# EAGLE schematic Thetis_RevF6_SCH (EAGLE 9.7.0)
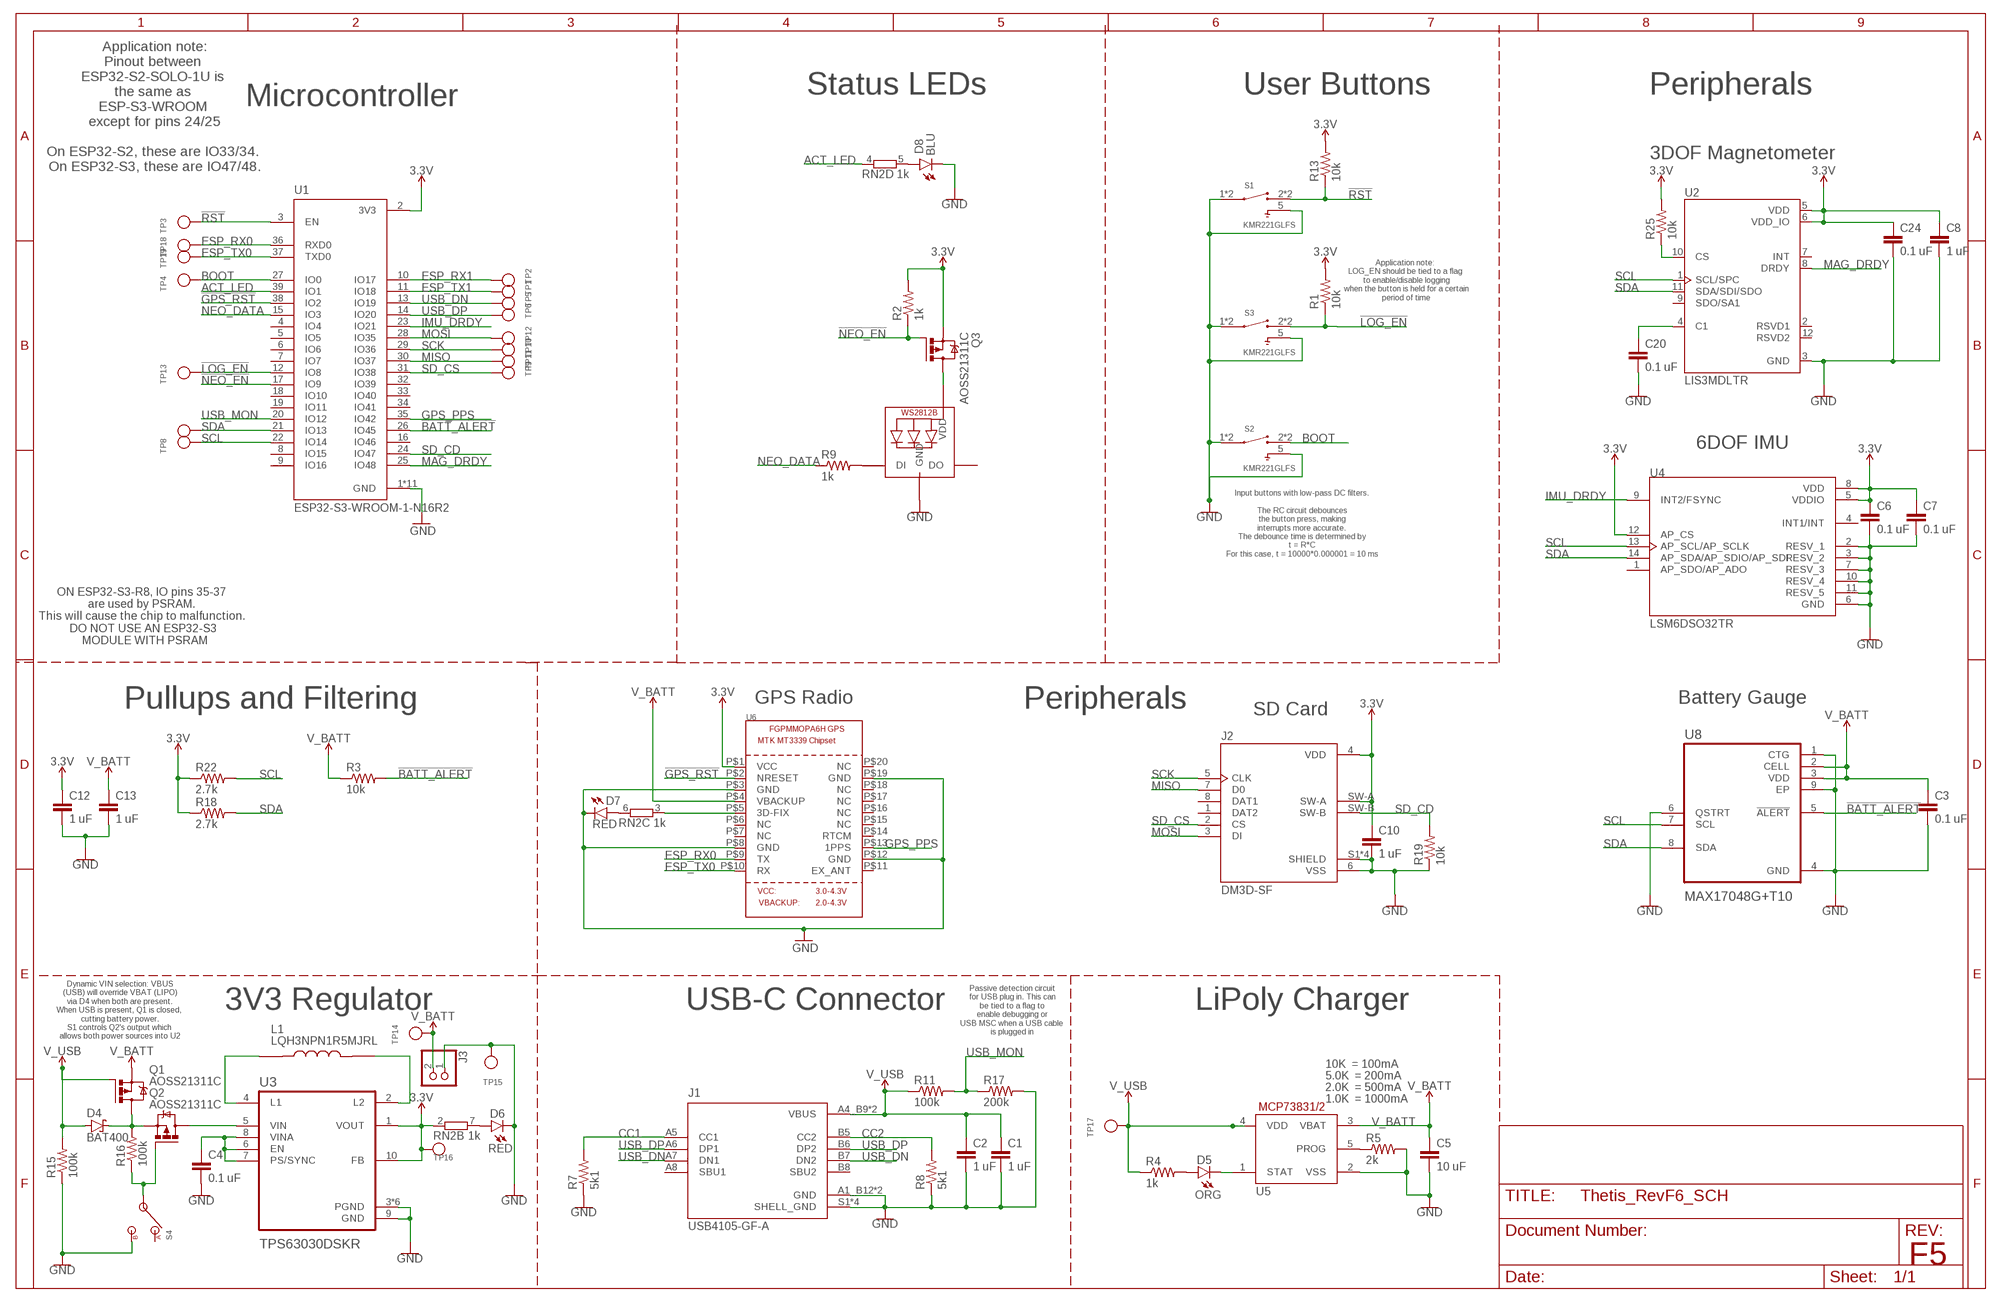
[diagram p0: schematic, sheet 1]

## Parts
C1  1 uF  C-EUC0603  [C0603]
C2  1 uF  C-EUC0603  [C0603]
C3  0.1 uF  C-EUC0603  [C0603]
C4  0.1 uF  C-EUC0603  [C0603]
C5  10 uF  C-EUC0603  [C0603]
C6  0.1 uF  C-EUC0603  [C0603]
C7  0.1 uF  C-EUC0603  [C0603]
C8  1 uF  C-EUC0603  [C0603]
C10  1 uF  C-EUC0603  [C0603]
C12  1 uF  C-EUC0603  [C0603]
C13  1 uF  C-EUC0603  [C0603]
C20  0.1 uF  C-EUC0603  [C0603]
C24  0.1 uF  C-EUC0603  [C0603]
D4  BAT400  BAS40  [SOT23]
D5  ORG  CHIP-ROUND-G_0603  [LEDC1608X65N]
D6  RED  CHIP-ROUND-G_0603  [LEDC1608X65N]
D7  RED  CHIP-FLAT-Y_0603-0.35MM  [LEDC1608X35N]
D8  BLU  CHIP-ROUND-G_0603  [LEDC1608X65N]
J1  USB4105-GF-A  [GCT_USB4105-GF-A]
J2  DM3D-SF  [HRS_DM3D-SF]
J3  JST_2PIN  [JSTPH2]
L1  LQH3NPN1R5MJRL  [IND_LQH3NPN1R5MJRL]
LED1  WS2812B3535  [LED3535]
Q1  AOSS21311C  PMOSFET_BSS84  [SOT23]
Q2  AOSS21311C  PMOSFET_BSS84  [SOT23]
Q3  AOSS21311C  PMOSFET_BSS84  [SOT23]
R1  10k  R-US_R0603  [R0603]
R2  1k  R-US_R0603  [R0603]
R3  10k  R-US_R0603  [R0603]
R4  1k  R-US_R0603  [R0603]
R5  2k  R-US_R0603  [R0603]
R7  5k1  R-US_R0603  [R0603]
R8  5k1  R-US_R0603  [R0603]
R9  1k  R-US_R0603  [R0603]
R11  100k  R-US_R0603  [R0603]
R13  10k  R-US_R0603  [R0603]
R15  100k  R-US_R0603  [R0603]
R16  100k  R-US_R0603  [R0603]
R17  200k  R-US_R0603  [R0603]
R18  2.7k  R-US_R0603  [R0603]
R19  10k  R-US_R0603  [R0603]
R22  2.7k  R-US_R0603  [R0603]
R25  10k  R-US_R0603  [R0603]
RN2  1k  4R-NEXBN8V  [EXBN8V]
S1  KMR221GLFS  [SW_KMR221GLFS]
S2  KMR221GLFS  [SW_KMR221GLFS]
S3  KMR221GLFS  [SW_KMR221GLFS]
S4  CL-SB-12X  [CL-SB-12A]
TP1  TESTPOINT1.5X2.0MM_NOCREAM  [PAD-1.5X2.0]
TP2  TESTPOINT1.5X2.0MM_NOCREAM  [PAD-1.5X2.0]
TP3  TESTPOINT1.5X2.0MM_NOCREAM  [PAD-1.5X2.0]
TP4  TESTPOINT1.5X2.0MM_NOCREAM  [PAD-1.5X2.0]
TP5  TESTPOINT1.5X2.0MM_NOCREAM  [PAD-1.5X2.0]
TP6  TESTPOINT1.5X2.0MM_NOCREAM  [PAD-1.5X2.0]
TP7  TESTPOINT1.5X2.0MM_NOCREAM  [PAD-1.5X2.0]
TP8  TESTPOINT1.5X2.0MM_NOCREAM  [PAD-1.5X2.0]
TP9  TESTPOINT1.5X2.0MM_NOCREAM  [PAD-1.5X2.0]
TP10  TESTPOINT1.5X2.0MM_NOCREAM  [PAD-1.5X2.0]
TP11  TESTPOINT1.5X2.0MM_NOCREAM  [PAD-1.5X2.0]
TP12  TESTPOINT1.5X2.0MM_NOCREAM  [PAD-1.5X2.0]
TP13  TESTPOINT1.5X2.0MM_NOCREAM  [PAD-1.5X2.0]
TP14  TESTPOINT1.5X2.0MM_NOCREAM  [PAD-1.5X2.0]
TP15  TESTPOINT1.5X2.0MM_NOCREAM  [PAD-1.5X2.0]
TP16  TESTPOINT1.5X2.0MM_NOCREAM  [PAD-1.5X2.0]
TP17  TESTPOINT1.5X2.0MM_NOCREAM  [PAD-1.5X2.0]
TP18  TESTPOINT1.5X2.0MM_NOCREAM  [PAD-1.5X2.0]
TP19  TESTPOINT1.5X2.0MM_NOCREAM  [PAD-1.5X2.0]
U1  ESP32-S3-WROOM-1-N16R2  [XCVR_ESP32-S3-WROOM-1-N16R2]
U2  LIS3MDLTR  [XDCR_LIS3MDLTR]
U3  TPS63030DSKR  [SON50P250X250X80-11N]
U4  LSM6DSO32TR  [PQFN50P300X250X97-14N]
U5  MCP73831/OT  [SOT23-5L]
U6  GPS_FGPMMOPA6H  [FGPMMOPA6H]
U8  MAX17048G+T10  [SON50P200X200X80-9N]

## Nets
3.3V: C6.1 C7.1 C8.1 C10.1 C12.1 C24.1 J2.4(VDD) J2.SW-A Q3.2(S) R1.2 R2.2 R13.2 R18.1 R22.1 R25.2 RN2.2 TP16.P$1 U1.2(3V3) U2.5(VDD) U2.6(VDD_IO) U3.1(VOUT) U3.10(FB) U4.5(VDDIO) U4.8(VDD) U4.12(AP_CS) U6.P$1(VCC)
!BATT_ALERT: R3.2 U1.26(IO45) U8.5(!ALERT)
!GPS_RST: U1.38(IO2) U6.P$2(NRESET)
!LOG_EN: R1.1 S3.2 S3.3 TP13.P$1 U1.12(IO8)
!NEO_EN: Q3.1(G) R2.1 U1.17(IO9)
!RST: R13.1 S1.2 S1.3 TP3.P$1 U1.3(EN)
ACT_LED: RN2.4 U1.39(IO1)
BOOT: S2.2 S2.3 TP4.P$1 U1.27(IO0)
CC1: J1.A5(CC1) R7.2
CC2: J1.B5(CC2) R8.2
ESP_RX0: TP18.P$1 U1.36(RXD0) U6.P$9(TX)
ESP_RX1: TP2.P$1 U1.10(IO17)
ESP_TX0: TP19.P$1 U1.37(TXD0) U6.P$10(RX)
ESP_TX1: TP1.P$1 U1.11(IO18)
GND: C1.2 C2.2 C3.2 C4.2 C5.2 C6.2 C7.2 C8.2 C10.2 C12.2 C13.2 C20.2 C24.2 D6.C D7.C D8.C J1.A1_B12(GND) J1.B1_A12(GND) J1.S1(SHELL_GND) J1.S2(SHELL_GND) J1.S3(SHELL_GND) J1.S4(SHELL_GND) J2.6(VSS) J2.S1(SHIELD) J2.S2(SHIELD) J2.S3(SHIELD) J2.S4(SHIELD) J3.1 LED1.4(GND) R5.2 R7.1 R8.1 R15.1 R17.2 R19.1 S1.1 S1.4 S1.5 S2.1 S2.4 S2.5 S3.1 S3.4 S3.5 S4.3 TP15.P$1 U1.1(GND) U1.40(GND) U1.41_1(GND) U1.41_2(GND) U1.41_3(GND) U1.41_4(GND) U1.41_5(GND) U1.41_6(GND) U1.41_7(GND) U1.41_8(GND) U1.41_9(GND) U2.3(GND) U3.3(PGND) U3.9(GND) U3.11(PGND) U3.12(PGND) U3.13(PGND) U3.14(PGND) U3.15(PGND) U4.2(RESV_1) U4.3(RESV_2) U4.6(GND) U4.7(RESV_3) U4.10(RESV_4) U4.11(RESV_5) U5.2(VSS) U6.P$3(GND) U6.P$8(GND) U6.P$12(GND) U6.P$19(GND) U8.1(CTG) U8.4(GND) U8.6(QSTRT) U8.9(EP)
GPS_PPS: U1.35(IO42) U6.P$13(1PPS)
IMU_DRDY: U1.23(IO21) U4.9(INT2/FSYNC)
MAG_DRDY: U1.25(IO48) U2.8(DRDY)
MISO: J2.7(D0) TP11.P$1 U1.30(IO37)
MOSI: J2.3(DI) TP12.P$1 U1.28(IO35)
N$1: Q2.1(G) R16.1 S4.2
N$2: D7.A RN2.6
N$3: D8.A RN2.5
N$4: Q2.3(D) U3.5(VIN)
N$5: LED1.2(VDD) Q3.3(D)
N$6: D6.A RN2.7
N$7: C20.1 U2.4(C1)
N$8: LED1.1(DI) R9.2
N$9: RN2.3 U6.P$5(3D-FIX)
N$10: L1.1 U3.4(L1)
N$12: L1.2 U3.2(L2)
N$13: D4.3(C) Q1.3(D) Q2.2(S) R16.2
N$15: R25.1 U2.10(CS)
N$16: C4.1 U3.6(EN) U3.7(PS/SYNC) U3.8(VINA)
N$20: D5.A R4.2
N$21: D5.C U5.1(STAT)
N$22: R5.1 U5.5(PROG)
NEO_DATA: R9.1 U1.15(IO3)
SCK: J2.5(CLK) TP10.P$1 U1.29(IO36)
SCL: R22.2 TP8.P$1 U1.22(IO14) U2.1(SCL/SPC) U4.13(AP_SCL/AP_SCLK) U8.7(SCL)
SD_CD: J2.SW-B R19.2 U1.24(IO47)
SD_CS: J2.2(CS) TP9.P$1 U1.31(IO38)
SDA: R18.2 TP7.P$1 U1.21(IO13) U2.11(SDA/SDI/SDO) U4.14(AP_SDA/AP_SDIO/AP_SDI) U8.8(SDA)
USB_DN: J1.A7(DN1) J1.B7(DN2) TP5.P$1 U1.13(IO19)
USB_DP: J1.A6(DP1) J1.B6(DP2) TP6.P$1 U1.14(IO20)
USB_MON: R11.2 R17.1 U1.20(IO12)
V_BATT: C3.1 C5.1 C13.1 J3.2 Q1.2(S) R3.1 TP14.P$1 U5.3(VBAT) U6.P$4(VBACKUP) U8.2(CELL) U8.3(VDD)
V_USB: C1.1 C2.1 D4.1(A) J1.A4_B9(VBUS) J1.B4_A9(VBUS) Q1.1(G) R4.1 R11.1 R15.2 TP17.P$1 U5.4(VDD)
Unconnected: J1.A8(SBU1) J1.B8(SBU2) J2.1(DAT2) J2.8(DAT1) LED1.3(DO) RN2.1 RN2.8 S4.1 U1.4(IO4) U1.5(IO5) U1.6(IO6) U1.7(IO7) U1.8(IO15) U1.9(IO16) U1.16(IO46) U1.18(IO10) U1.19(IO11) U1.32(IO39) U1.33(IO40) U1.34(IO41) U2.2(RSVD1) U2.7(INT) U2.9(SDO/SA1) U2.12(RSVD2) U4.1(AP_SDO/AP_ADO) U4.4(INT1/INT) U6.P$6(NC) U6.P$7(NC) U6.P$11(EX_ANT) U6.P$14(RTCM) U6.P$15(NC) U6.P$16(NC) U6.P$17(NC) U6.P$18(NC) U6.P$20(NC)

## Notes on the sheet
- Status LEDs | User Buttons | Peripherals
- Microcontroller
- Application note:
  Pinout between 
  ESP32-S2-SOLO-1U is 
  the same as 
  ESP-S3-WROOM 
  except for pins 24/25
  
  On ESP32-S2, these are IO33/34. 
  On ESP32-S3, these are IO47/48.
- 3DOF Magnetometer
- Application note: 
  LOG_EN should be tied to a flag 
  to enable/disable logging
  when the button is held for a certain
  period of time
- 6DOF IMU
- Input buttons with low-pass DC filters.
  
  The RC circuit debounces
  the button press, making
  interrupts more accurate.
  The debounce time is determined by
  t = R*C
  For this case, t = 10000*0.000001 = 10 ms
- ON ESP32-S3-R8, IO pins 35-37 
  are used by PSRAM. 
  This will cause the chip to malfunction. 
  DO NOT USE AN ESP32-S3
   MODULE WITH PSRAM
- Pullups and Filtering | GPS Radio | Peripherals | Battery Gauge
- SD Card
- 3V3 Regulator | USB-C Connector | LiPoly Charger
- Dynamic VIN selection: VBUS
  (USB) will override VBAT (LIPO)
  via D4 when both are present.
  When USB is present, Q1 is closed, 
  cutting battery power.
  S1 controls Q2's output which 
  allows both power sources into U2
- Passive detection circuit
  for USB plug in. This can
  be tied to a flag to
  enable debugging or
  USB MSC when a USB cable 
  is plugged in
- 10K  = 100mA
- 5.0K  = 200mA
- 2.0K  = 500mA
- 1.0K  = 1000mA
- F5

## Library data of the parts
C1-C8 C10 C12 C13 C20 C24 = rcl:C-EU: CAPACITOR, European symbol; SPICEPREFIX: C
D4 = diode:BAS40: Silicon Schottky Diodes General-purpose diode for high-speed switching
D5 D6 D8 = LED:CHIP-ROUND-G; CATEGORY: LED; COLOR: GREEN; DESCRIPTION: CHIP LED ROUND; SUB-CATEGORY: CHIP; TYPE: ROUND_TOP
D7 = LED:CHIP-FLAT-Y; CATEGORY: LED; COLOR: YELLOW; DESCRIPTION: CHIP LED FLAT; SUB-CATEGORY: CHIP; TYPE: FLAT_TOP
J1 = USB4105-GF-A:USB4105-GF-A: USB-C (USB TYPE-C) USB 2.0 Receptacle Connector 24 (16+8 Dummy) Position Surface Mount, Right Angle; Through Hole Check prices <https://pricing.snapeda.com/parts/USB4105-GF-A/GCT/view-part?ref=eda>; AVAILABILITY: In Stock; DESCRIPTION: USB-C (USB TYPE-C) USB 2.0 Receptacle Connector 24 (16+8 Dummy) Position Surface Mount, Right Angle; Through Hole; MF: GCT; MP: USB4105-GF-A; PACKAGE: None; PRICE: None; PURCHASE-URL: https://pricing.snapeda.com/search/part/USB4105-GF-A/?ref=eda
J2 = UTL-Lib:DM3D-SF: Right Angle SMT Top Board Mount Push-Pull No Ejection MicroSD Connector; MANUFACTURER: Hirose; MAXIMUM_PACKAGE_HEIGHT: 1.55mm; PARTREV: 2017.1; STANDARD: Manufacturer Recommendations
J3 = UTL-Lib:JST_2PIN: JST 2-Pin Right-Angle Connector PH-Series - 4UConnector: 17311 SH-Series - 4UConnector: 07278
L1 = UTL-Lib:LQH3NPN1R5MJRL: Inductor Power Chip Shielded Wirewound 33uH 20% 1MHz Ferrite 0.63A 0.948Ohm DCR 1212 T/R; CHECK_PRICES: https://www.snapeda.com/parts/LQH3NPN1R5MJRL/Murata+Electronics+North+America/view-part/?ref=eda; DESCRIPTION: 1.5 µH Shielded Drum Core, Wirewound Inductor 1.1 A 58.8mOhm Max 1212 (3030 Metric); DIGIKEY_PART_NUMBER: 490-9576-2-ND; MF: Murata Electronics; MP: LQH3NPN1R5MJRL; PACKAGE: NONSTANDARD; PURCHASE-URL: https://www.snapeda.com/api/url_track_click_mouser/?unipart_id=1017998&manufacturer=Murata Electronics&part_name=LQH3NPN1R5MJRL&search_term=None; SNAPEDA_LINK: https://www.snapeda.com/parts/LQH3NPN1R5MJRL/Murata+Electronics+North+America/view-part/?ref=snap
LED1 = adafruit:WS2812B
Q1-Q3 = Transistor:PMOSFET_: P-Channel MOSFET - Popular parts; CATEGORY: Transistor; DESCRIPTION: MOSFET P-CH 50V 130MA SOT-23; DRAIN_CURRENT: 130mA; MANUFACTURER: ON Semiconductor; MPN: BSS84; OPERATING_TEMP: -55°C ~ 150°C; PART_STATUS: Active; ROHS_COMPLIANT: Yes; SUB-CATEGORY: MOSFET; THERMALLOSS: 360mW; TYPE: P-Channel; VALUE: BSS84
R1-R5 R7-R9 R11 R13 R15-R19 R22 R25 = rcl:R-US_: RESISTOR, American symbol; SPICEPREFIX: R
RN2 = resistor-dil-Poseidon-Edit:4R-N: Array Chip Resistor Source: RS Component / Phycomp; OC_FARNELL: unknown; OC_NEWARK: unknown
S1-S3 = KMR221GLFS:KMR221GLFS: Switch Tactile N.O. SPST Button Gull Wing 0.05A 32VDC 1VA 200000Cycles 2N SMD Automotive T/R; MANUFACTURER: CnK
S4 = switches:CL-SB-12X: SWITCH SLIDE SPDT 0.2A JLEAD; DIGIKEY: 563-1314-1-ND
TP1-TP19 = microbuilder:TESTPOINT: Test Point Various test points for characterisation and PCB testing TESTPOINT_SMT - Compact Surface Mount Test Point [Digikey: 5016KTR-ND]
U1 = UTL-Lib:ESP32-S3-WROOM-1-N16R2: Check availability <https://pricing.snapeda.com/parts/ESP32-S3-WROOM-1-N16R2/Espressif%20Systems/view-part?ref=eda>; AVAILABILITY: In Stock; CHECK_PRICES: https://www.snapeda.com/parts/ESP32-S3-WROOM-1-N16R2/Espressif+Systems/view-part/?ref=eda; DESCRIPTION: Bluetooth, WiFi 802.11b/g/n, Bluetooth v5.0 Transceiver Module 2.4GHz PCB Trace Surface Mount; MF: Espressif Systems; MP: ESP32-S3-WROOM-1-N16R2; PACKAGE: None; PRICE: None; PURCHASE-URL: https://www.snapeda.com/api/url_track_click_mouser/?unipart_id=11099128&manufacturer=Espressif Systems&part_name=ESP32-S3-WROOM-1-N16R2&search_term=esp32-s3-wroom-1; SNAPEDA_LINK: https://www.snapeda.com/parts/ESP32-S3-WROOM-1-N16R2/Espressif+Systems/view-part/?ref=snap
U2 = UTL-Lib:LIS3MDLTR: LIS3MDL Series 3 Axis ±2/±8/±12/±16 g 3.6V High Performance Magnetometer LGA-12; AVAILABILITY: Unavailable; DESCRIPTION: LIS3MDL Series 3 Axis ±2/±8/±12/±16 g 3.6V High Performance Magnetometer LGA-12; MAXIMUM_PACKAGE_HEIGHT: 1mm; MF: STMicroelectronics; MP: LIS3MDLTR; PACKAGE: VFLGA-12 STMicroelectronics; PARTREV: 6; PRICE: None; STANDARD: Manufacturer Recommendation
U3 = UTL-Lib:TPS63030DSKR: Check availability <https://pricing.snapeda.com/parts/TPS63030DSKR/Texas%20Instruments/view-part?ref=eda>; AVAILABILITY: In Stock; CHECK_PRICES: https://www.snapeda.com/parts/TPS63030DSKR/Texas+Instruments/view-part/?ref=eda; DESCRIPTION: High Efficient Single Inductor Buck-Boost Converter with 1-A Switches; MF: Texas Instruments; MP: TPS63030DSKR; PACKAGE: WSON-10 Texas Instruments; PRICE: None; PURCHASE-URL: https://www.snapeda.com/api/url_track_click_mouser/?unipart_id=1101370&manufacturer=Texas Instruments&part_name=TPS63030DSKR&search_term=tps63030dskr; SNAPEDA_LINK: https://www.snapeda.com/parts/TPS63030DSKR/Texas+Instruments/view-part/?ref=snap
U4 = UTL-Lib:LSM6DSO32TR: Single-Interface MotionTracking device The ICM-42605 is a 6-axis MotionTracking device that combines a 3-axis gyroscope, and a 3-axis accelerometer in a small 2.5x3x0.91 mm (14-pin LGA) package. It also features a 2K-byte FIFO that can lower the traffic on the serial bus interface, and reduce power consumption by allowing the system processor to burst read sensor data and then go into a low-power mode.; MANUFACTURER: TDK Corporation; PARTREV: 0.4; STANDARD: IPC 7351B
U5 = adafruit - EVE Edit:MCP73831: MCP73831/2 Miniature Single-Cell, Fully Integrated Li-Ion, Li-Polymer Charge Management Controllers. Nice and small simple lipoly charge controller, with adjustable current and status output (LED) http://www.ladyada.net/library/pcb/eaglelibrary.html
U6 = adafruit - EVE Edit:GPS_FGPMMOPA6H: GPS Module - MTK MT3339 Chipset, -165dBm sensitivity, 22 channels, 10Hz, auto-select external antenna options
U8 = UTL-Lib:MAX17048G+T10

## Net classes
0 default: width 0.178 mm
1 highpower: width 0.305 mm, drill 0.483 mm
2 lowpower: width 0.305 mm, drill 0.483 mm